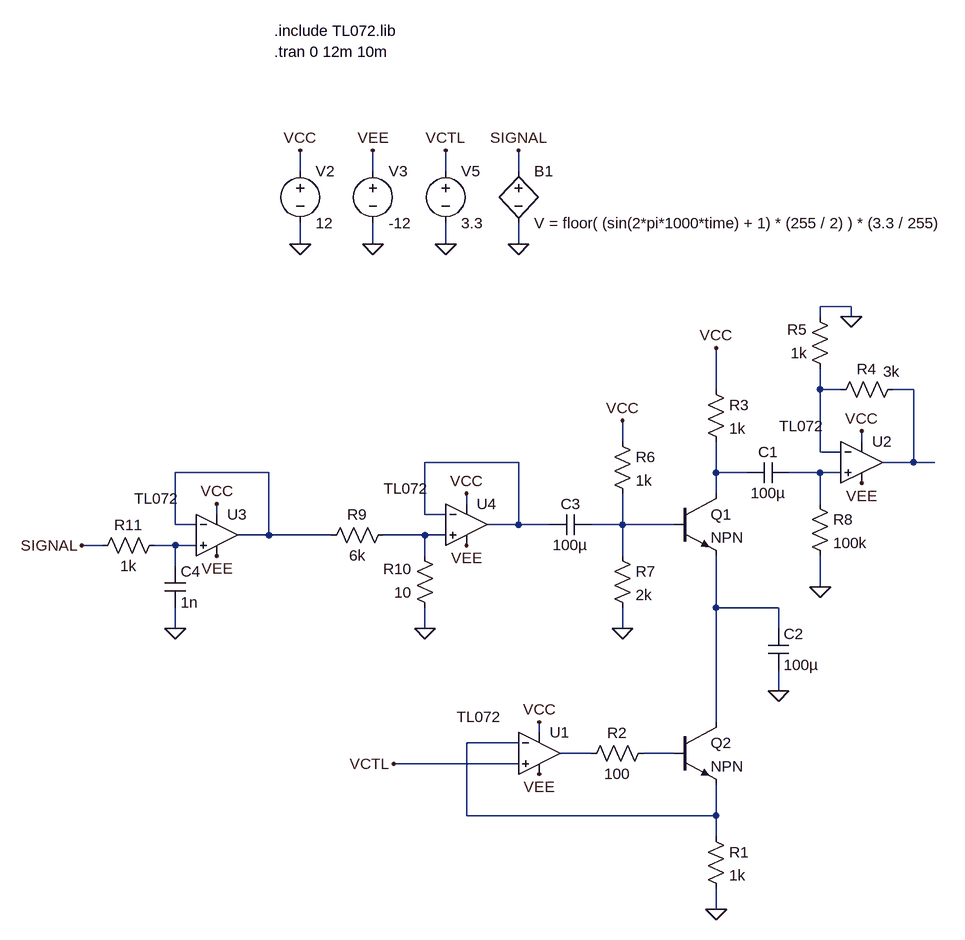
[diagram p0: schematic vca.asc]
vca.asc, the LTspice schematic file:
Version 4.1
SHEET 1 1236 1304
WIRE -384 -448 -384 -480
WIRE -272 -448 -272 -480
WIRE -160 -448 -160 -480
WIRE -48 -448 -48 -480
WIRE -384 -336 -384 -368
WIRE -272 -336 -272 -368
WIRE -160 -336 -160 -368
WIRE -48 -336 -48 -368
WIRE 464 -240 416 -240
WIRE 416 -224 416 -240
WIRE 464 -224 464 -240
WIRE 256 -112 256 -176
WIRE 416 -112 416 -144
WIRE 448 -112 416 -112
WIRE 560 -112 528 -112
WIRE 112 -32 112 -64
WIRE 480 -32 480 -48
WIRE 416 -16 416 -112
WIRE 448 -16 416 -16
WIRE -48 0 -192 0
WIRE 560 0 560 -112
WIRE 560 0 512 0
WIRE 592 0 560 0
WIRE -432 16 -576 16
WIRE 256 16 256 -32
WIRE 304 16 256 16
WIRE 416 16 368 16
WIRE 448 16 416 16
WIRE 256 48 256 16
WIRE -128 64 -128 48
WIRE 416 64 416 16
WIRE -512 80 -512 64
WIRE -192 80 -192 0
WIRE -160 80 -192 80
WIRE -576 96 -576 16
WIRE -544 96 -576 96
WIRE -48 96 -48 0
WIRE -48 96 -96 96
WIRE 0 96 -48 96
WIRE 112 96 112 48
WIRE 112 96 64 96
WIRE 192 96 112 96
WIRE -432 112 -432 16
WIRE -432 112 -480 112
WIRE -336 112 -432 112
WIRE -192 112 -256 112
WIRE -160 112 -192 112
WIRE -688 128 -720 128
WIRE -576 128 -608 128
WIRE -544 128 -576 128
WIRE -192 144 -192 112
WIRE 112 144 112 96
WIRE -576 160 -576 128
WIRE 416 192 416 144
WIRE 256 224 256 144
WIRE 352 224 256 224
WIRE -576 256 -576 224
WIRE -192 256 -192 224
WIRE 112 256 112 224
WIRE 352 256 352 224
WIRE 352 352 352 320
WIRE 256 400 256 224
WIRE -16 416 -16 400
WIRE -48 432 -128 432
WIRE 64 448 16 448
WIRE 192 448 144 448
WIRE -48 464 -240 464
WIRE -128 544 -128 432
WIRE 256 544 256 496
WIRE 256 544 -128 544
WIRE 256 576 256 544
WIRE 256 688 256 656
FLAG -384 -336 0
FLAG -272 -336 0
FLAG -384 -480 VCC
FLAG -272 -480 VEE
FLAG -16 400 VCC
FLAG -16 480 VEE
FLAG 352 352 0
FLAG -192 256 0
FLAG -128 48 VCC
FLAG -128 128 VEE
FLAG -240 464 VCTL
FLAG -160 -336 0
FLAG -160 -480 VCTL
FLAG 112 256 0
FLAG 256 688 0
FLAG 416 192 0
FLAG 112 -64 VCC
FLAG 256 -176 VCC
FLAG 480 -48 VCC
FLAG 480 32 VEE
FLAG 464 -224 0
FLAG -48 -336 0
FLAG -48 -480 SIGNAL
FLAG -512 64 VCC
FLAG -512 144 VEE
FLAG -576 256 0
FLAG -720 128 SIGNAL
SYMBOL npn 192 48 R0
SYMATTR InstName Q1
SYMBOL npn 192 400 R0
SYMATTR InstName Q2
SYMBOL OpAmps\\opamp2 -16 384 R0
WINDOW 3 -127 8 Left 2
SYMATTR Value TL072
SYMATTR InstName U1
SYMBOL voltage -384 -464 R0
WINDOW 123 0 0 Left 0
WINDOW 39 0 0 Left 0
SYMATTR InstName V2
SYMATTR Value 12
SYMBOL voltage -272 -464 R0
WINDOW 123 0 0 Left 0
WINDOW 39 0 0 Left 0
SYMATTR InstName V3
SYMATTR Value -12
SYMBOL res 240 560 R0
SYMATTR InstName R1
SYMATTR Value 1k
SYMBOL res 160 432 R90
WINDOW 0 0 56 VBottom 2
WINDOW 3 32 56 VTop 2
SYMATTR InstName R2
SYMATTR Value 100
SYMBOL res 240 -128 R0
SYMATTR InstName R3
SYMATTR Value 1k
SYMBOL cap 368 0 R90
WINDOW 0 0 32 VBottom 2
WINDOW 3 32 32 VTop 2
SYMATTR InstName C1
SYMATTR Value 100µ
SYMBOL cap 336 256 R0
SYMATTR InstName C2
SYMATTR Value 100µ
SYMBOL res -240 96 R90
WINDOW 0 0 56 VBottom 2
WINDOW 3 32 56 VTop 2
SYMATTR InstName R9
SYMATTR Value 6k
SYMBOL res -176 240 R180
WINDOW 0 36 76 Left 2
WINDOW 3 36 40 Left 2
SYMATTR InstName R10
SYMATTR Value 10
SYMBOL OpAmps\\opamp2 -128 32 R0
WINDOW 3 -127 8 Left 2
SYMATTR Value TL072
SYMATTR InstName U4
SYMBOL voltage -160 -464 R0
WINDOW 123 0 0 Left 0
WINDOW 39 0 0 Left 0
SYMATTR InstName V5
SYMATTR Value 3.3
SYMBOL res 96 -48 R0
SYMATTR InstName R6
SYMATTR Value 1k
SYMBOL res 96 128 R0
SYMATTR InstName R7
SYMATTR Value 2k
SYMBOL res 400 48 R0
SYMATTR InstName R8
SYMATTR Value 100k
SYMBOL cap 64 80 R90
WINDOW 0 0 32 VBottom 2
WINDOW 3 32 32 VTop 2
SYMATTR InstName C3
SYMATTR Value 100µ
SYMBOL OpAmps\\opamp2 480 -64 R0
WINDOW 3 -127 8 Left 2
SYMATTR Value TL072
SYMATTR InstName U2
SYMBOL res 544 -128 R90
WINDOW 0 0 56 VBottom 2
WINDOW 3 -27 18 VTop 2
SYMATTR InstName R4
SYMATTR Value 3k
SYMBOL res 432 -128 R180
WINDOW 0 36 76 Left 2
WINDOW 3 36 40 Left 2
SYMATTR InstName R5
SYMATTR Value 1k
SYMBOL bv -48 -464 R0
SYMATTR InstName B1
SYMATTR Value V = floor( (sin(2*pi*1000*time) + 1) * (255 / 2) ) * (3.3 / 255)
SYMBOL OpAmps\\opamp2 -512 48 R0
WINDOW 3 -127 8 Left 2
SYMATTR Value TL072
SYMATTR InstName U3
SYMBOL res -592 112 R90
WINDOW 0 0 56 VBottom 2
WINDOW 3 32 56 VTop 2
SYMATTR InstName R11
SYMATTR Value 1k
SYMBOL cap -592 160 R0
SYMATTR InstName C4
SYMATTR Value 1n
TEXT -424 -664 Left 2 !.include TL072.lib
TEXT -424 -632 Left 2 !.tran 0 12m 10m

The netlist it stands for:
* vca.asc
Q1 N005 N007 N010 0 NPN
Q2 N010 N013 N011 0 NPN
X§U1 VCTL N011 VCC VEE N012 TL072  ; pins In+ In- V+ V- OUT
V2 VCC 0 12
V3 VEE 0 -12
R1 N011 0 1k
R2 N013 N012 100
R3 VCC N005 1k
C1 N006 N005 100µ
C2 N010 0 100µ
R9 N008 N004 6k
R10 0 N008 10
X§U4 N008 N003 VCC VEE N003 TL072  ; pins In+ In- V+ V- OUT
V5 VCTL 0 3.3
R6 VCC N007 1k
R7 N007 0 2k
R8 N006 0 100k
C3 N007 N003 100µ
X§U2 N006 N001 VCC VEE N002 TL072  ; pins In+ In- V+ V- OUT
R4 N002 N001 3k
R5 N001 0 1k
B1 SIGNAL 0 V = floor( (sin(2*pi*1000*time) + 1) * (255 / 2) ) * (3.3 / 255)
X§U3 N009 N004 VCC VEE N004 TL072  ; pins In+ In- V+ V- OUT
R11 N009 SIGNAL 1k
C4 N009 0 1n
.model NPN NPN
.model PNP PNP
.lib standard.bjt
.include TL072.lib
.tran 0 12m 10m
.backanno
.end